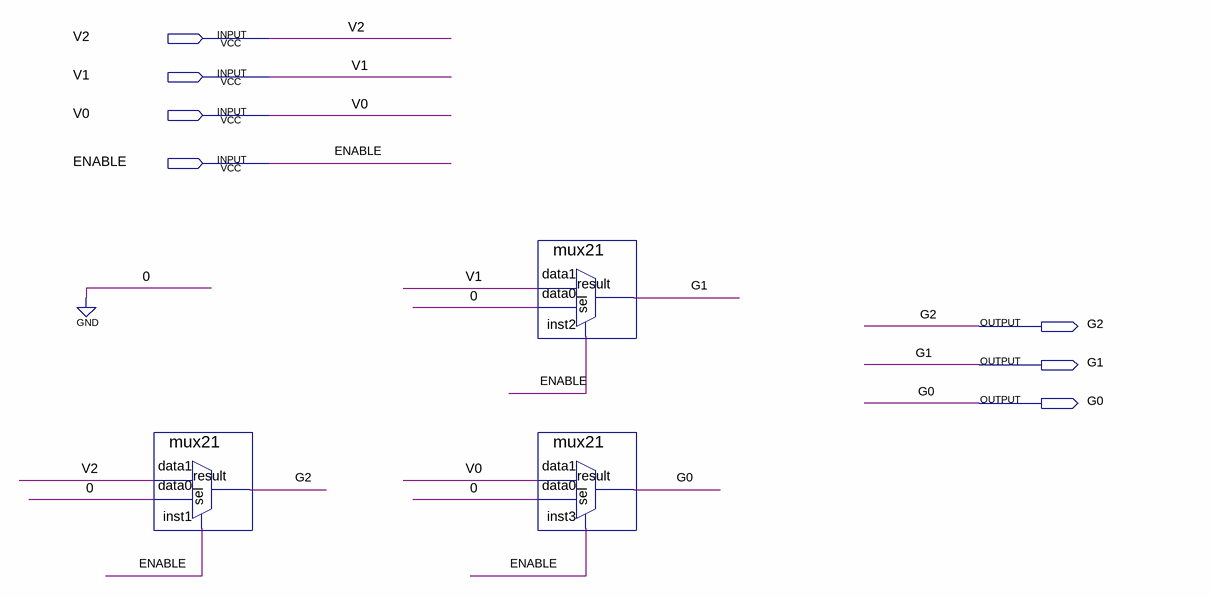
[diagram p0: schematic sheet]
// Quartus schematic ADD_DICE_ROLL.bdf as structural Verilog: 3 symbols, 7 pins
module ADD_DICE_ROLL (
  input  V2,
  input  V1,
  input  V0,
  input  ENABLE,
  output G2,
  output G1,
  output G0
);

  mux21 inst1 (.data1(V2), .data0(1'b0), .sel(ENABLE), .result(G2));
  mux21 inst2 (.data1(V1), .data0(1'b0), .sel(ENABLE), .result(G1));
  mux21 inst3 (.data1(V0), .data0(1'b0), .sel(ENABLE), .result(G0));
endmodule
